# EAGLE design poe-assembly (EAGLE 9.7.0)
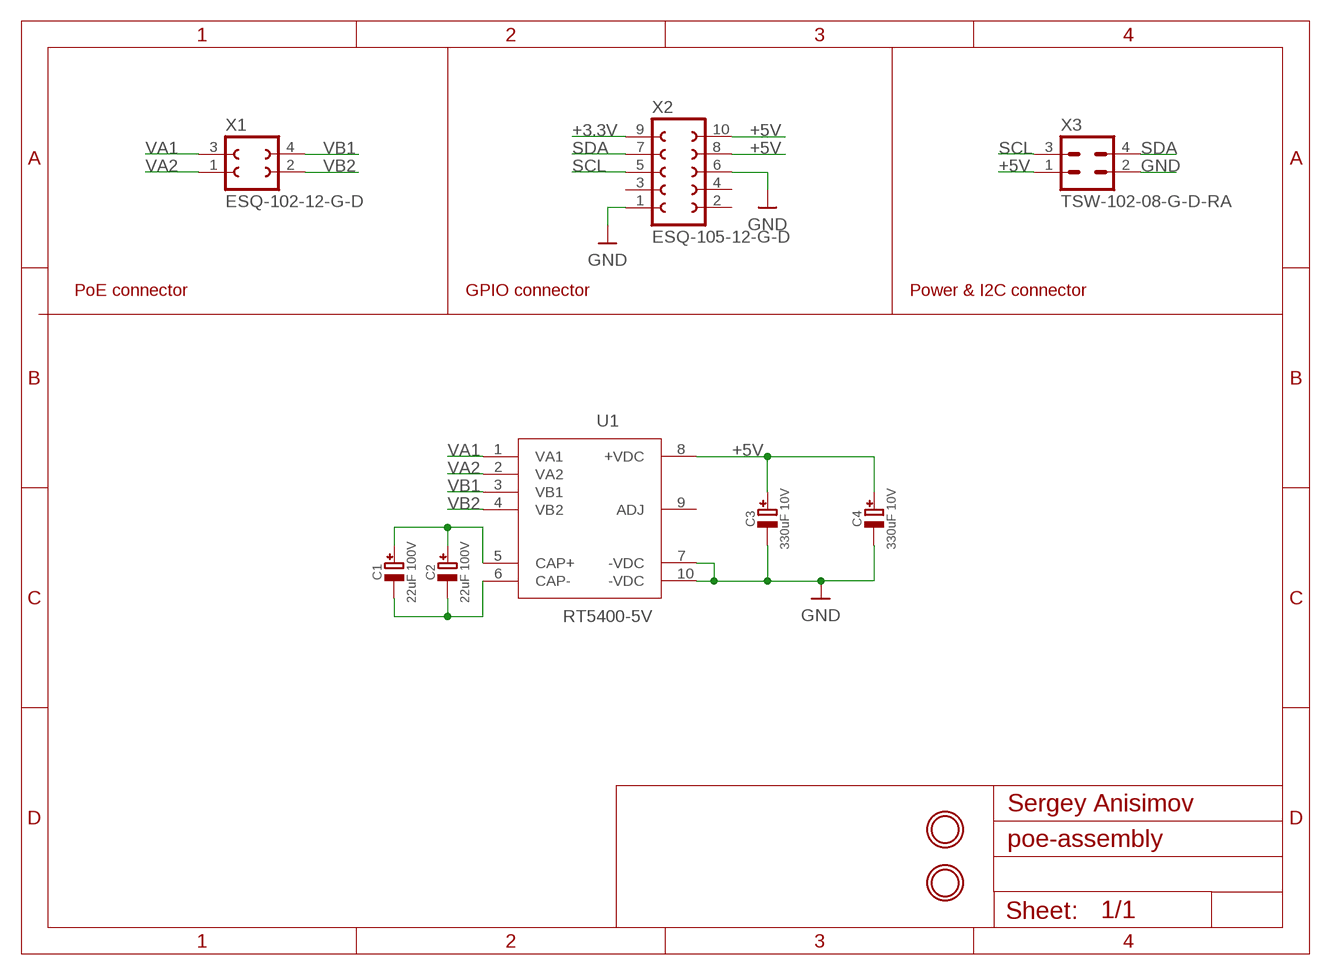
[diagram p0: schematic, sheet 1]

## Parts
C1  22uF 100V  CAPACITOR_POLCAP-PRD250-W50-D630  [CAP-PRD250-W50-D630]
C2  22uF 100V  CAPACITOR_POLCAP-PRD250-W50-D630  [CAP-PRD250-W50-D630]
C3  330uF 10V  CAPACITOR_POLCAP-PRD250-W50-D630  [CAP-PRD250-W50-D630]
C4  330uF 10V  CAPACITOR_POLCAP-PRD250-W50-D630  [CAP-PRD250-W50-D630]
U1  RT5400-5V  MODULE-RT5400  [MODULE-RT5400]
U$6  MOUNTING-HOLE2.7_THICK  [MOUNTINGHOLE_2.7_PLATED_THICK]
U$7  MOUNTING-HOLE2.7_THICK  [MOUNTINGHOLE_2.7_PLATED_THICK]
X1  ESQ-102-12-G-D  CON-FE-02-02ESQ-102-12-S-D  [ESQ-102-D]
X2  ESQ-105-12-G-D  CON-FE-05-02ESQ-105-12-S-D  [ESQ-105-D]
X3  TSW-102-08-G-D-RA  CON-MA-02-02  [TSW-102-D-RA]

## Nets
+3.3V: X2.9
+5V: C3.1(+) C4.1(+) U1.8(+VDC) X2.8 X2.10 X3.1
GND: C3.2(-) C4.2(-) U1.7(-VDC) U1.10(-VDC) X2.1 X2.6 X3.2
N$1: C1.1(+) C2.1(+) U1.5(CAP+)
N$2: C1.2(-) C2.2(-) U1.6(CAP-)
SCL: X2.5 X3.3
SDA: X2.7 X3.4
VA1: U1.1(VA1) X1.3
VA2: U1.2(VA2) X1.1
VB1: U1.3(VB1) X1.4
VB2: U1.4(VB2) X1.2
Unconnected: U1.9(ADJ) X2.2 X2.3 X2.4

## Notes on the sheet
- PoE connector | GPIO connector | Power & I2C connector
- Sergey Anisimov

## Library data of the parts
C1-C4 = Library:CAPACITOR_POL
U1 = Library:MODULE-RT5400
U$6 U$7 = Library:MOUNTING-HOLE: Mounting Hole For #2 screws (0.086"/2.18mm width, 0.094"/2.4mm hole) use 2.5mm; BOM: EXCLUDE
X1 = Library:CON-FE-02-02
X2 = Library:CON-FE-05-02
X3 = Library:CON-MA-02-02

## Board
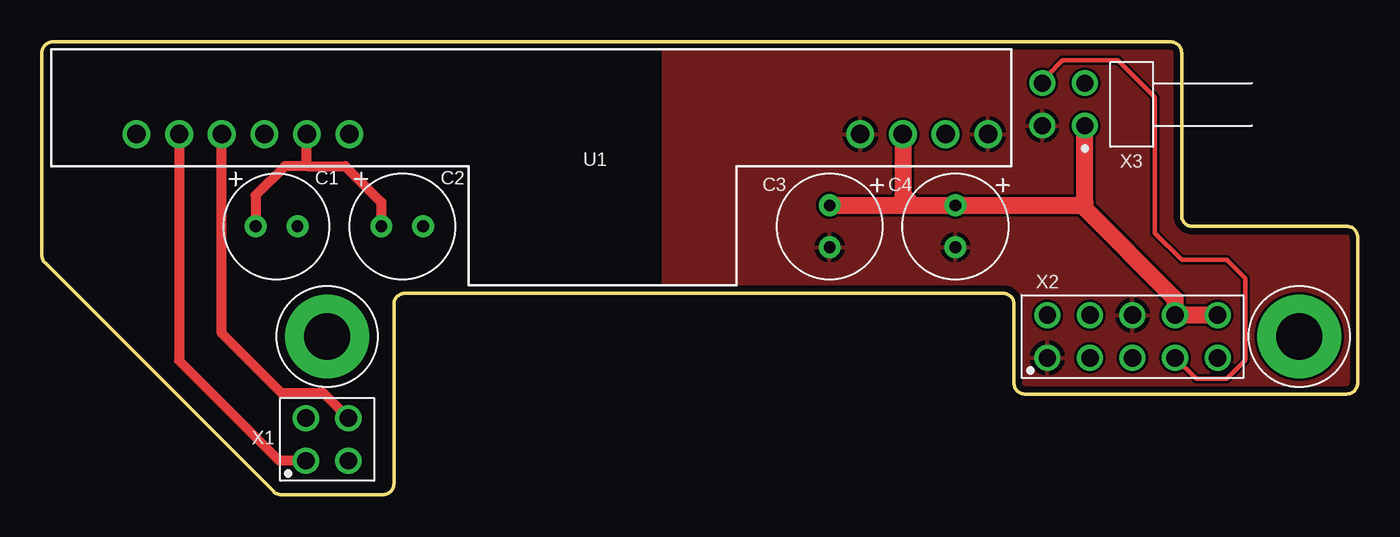
[diagram p1: board, top side]
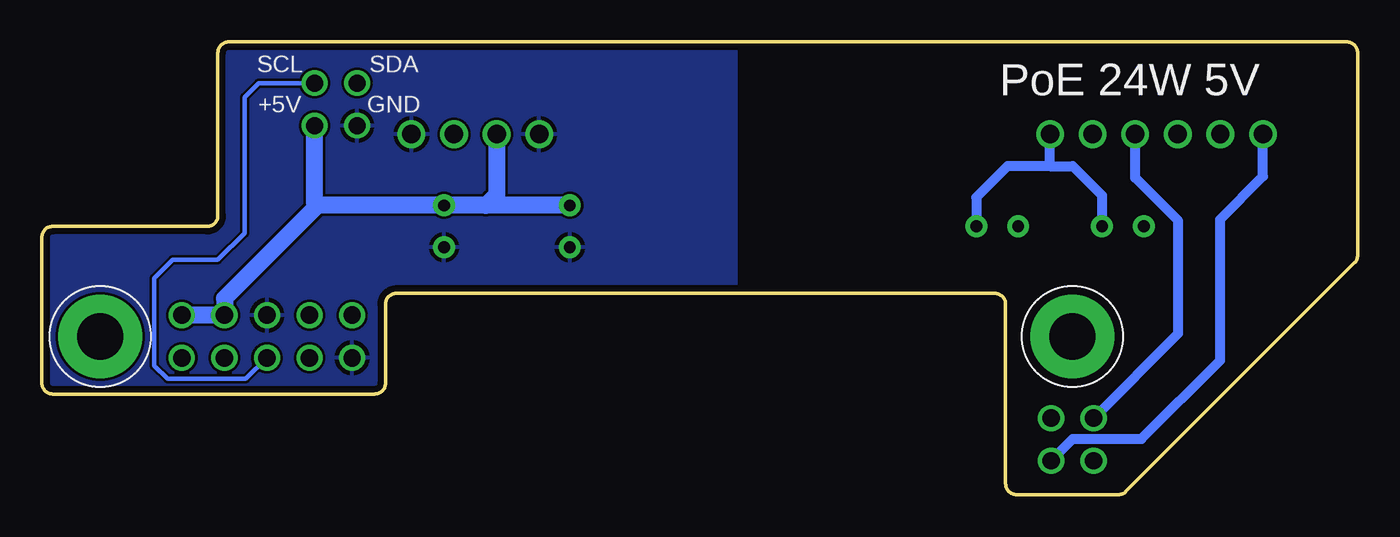
[diagram p2: board, bottom side, seen from below]

Size 78.5 x 27 mm. Coordinates in mm from the lower left corner, seen from the top.
Outline: 58.63,6 77.86,6 arc90 78.5,6.63 78.5,15.36 arc90 77.86,16 68.63,16 arc-90 68,16.64 68,26.36 arc90 67.37,27 0.63,27 arc90 0,26.36 0,14.26 arc45 0.19,13.81 13.81,0.19 arc45 14.26,0 20.37,0 arc90 21,0.63 21,11.37 arc-90 21.63,12 57.37,12 arc-90 58,11.37 58,6.63 arc90 58.63,6
Copper layers (1*16): Top 0.035559375mm / dielectric 1.6mm / Bottom 0.035559375mm
Design rules "oshpark-2layer": minimum track width 6mil, minimum drill 10mil, track to track 6mil, track to pad 6mil, pad to pad 6mil, via to via 6mil, smd to smd 6mil, copper to edge 15mil, drill to drill 6mil, minimum pad ring 5mil, minimum via ring 5mil, stop-mask expansion 2.5mil, vias tented up to drill 0mil, thermal gap 10mil

### Footprints (pad centres in the part's own frame; a part is rotated, then mirrored left to right if it is on the bottom)
CAP-PRD250-W50-D630 = drill 0.7 pad 1.3: 1 -1.25,0; 2 1.25,0
MODULE-RT5400 = drill 1.1: 1 -7.62,0; 2 -5.08,0; 3 -2.54,0; 4 0,0; 5 2.54,0; 6 5.08,0; 7 35.56,0; 8 38.1,0; 9 40.64,0; 10 43.18,0
MOUNTINGHOLE_2.7_PLATED_THICK = drill 2.75 pad 5: P$1 0,0
ESQ-102-D = drill 1.04: 1 0,-2.54; 2 0,0; 3 2.54,-2.54; 4 2.54,0
ESQ-105-D = drill 1.04: 1 0,-2.54; 2 0,0; 3 2.54,-2.54; 4 2.54,0; 5 5.08,-2.54; 6 5.08,0; 7 7.62,-2.54; 8 7.62,0; 9 10.16,-2.54; 10 10.16,0
TSW-102-D-RA = drill 1.02: 1 0,0; 2 0,2.54; 3 2.54,0; 4 2.54,2.54

### Placement (x,y rotation side)
C1  14,16 0 top
C2  21.5,16 0 top
C3  47,16 270 top
C4  54.5,16 270 top
U1  13.27,21.5 0 top
U$6  75.02,9.43 0 top
U$7  17.02,9.43 0 top
X1  15.75,4.56 0 top
X2  59.99,10.7 0 top
X3  62.23,22 90 top

### Tracks (layer width: path | path; a pad name or v marks a point on that pad's centre or on a via)
+5V
  Top 1.016: 62.05,17.25 67.61,11.69 X2.8 X2.10 | C3.1 52,17.25 | 52,17.25 C4.1 62.05,17.25 | U1.8 51.37,17.88 52,17.25 | 62.05,17.25 62.23,17.43 X3.1
  Bottom 1.016: 62.06,17.25 67.61,11.7 X2.8 X2.10 | C3.1 52,17.25 | 52,17.25 C4.1 62.06,17.25 | U1.8 51.37,17.88 52,17.25 | 62.06,17.25 62.23,17.42 X3.1
GND
  pour Top: 37.1,-0.9 81.9,-0.9 81.9,28.9 37.1,28.9
  pour Bottom (rank 3): 37.1,-0.9 81.9,-0.9 81.9,28.9 37.1,28.9
N$1
  Top 0.61: 15.81,19.59 18.1,19.59 20.25,17.44 C2.1 | 15.81,19.59 14.5,19.59 12.75,17.84 C1.1 | 15.81,19.59 U1.5
N$2
  Bottom 0.61: 18.35,19.59 17,19.59 15.25,17.84 C1.2 | 18.35,19.59 20.89,19.59 22.75,17.73 C2.2 | 18.35,19.59 U1.6
SCL
  Bottom 0.254: X2.5 66.33,6.9 71,6.9 71.8,7.7 71.8,12.9 70.7,14 68,14 66.4,15.6 66.4,23.7 65.56,24.55 X3.3
SDA
  Top 0.254: X2.7 68.87,6.9 70.7,6.9 71.8,8 71.8,12.9 70.7,14 68,14 66.4,15.6 66.4,23.7 64.2,25.9 60.9,25.9 59.99,24.99 X3.4
VA1
  Bottom 0.61: X1.3 16.99,3.32 12.89,3.32 8.22,7.99 8.22,16.41 5.65,18.98 U1.1
VA2
  Top 0.61: U1.2 8.19,7.99 14.16,2.02 X1.1
VB1
  Top 0.61: U1.3 10.73,9.62 14.3,6.05 16.8,6.05 X1.4
VB2
  Bottom 0.61: X1.2 10.7,9.61 10.7,16.32 13.27,18.89 U1.4

### Text on the board
bNames: SDA | SCL | PoE 24W 5V | GND | +5V